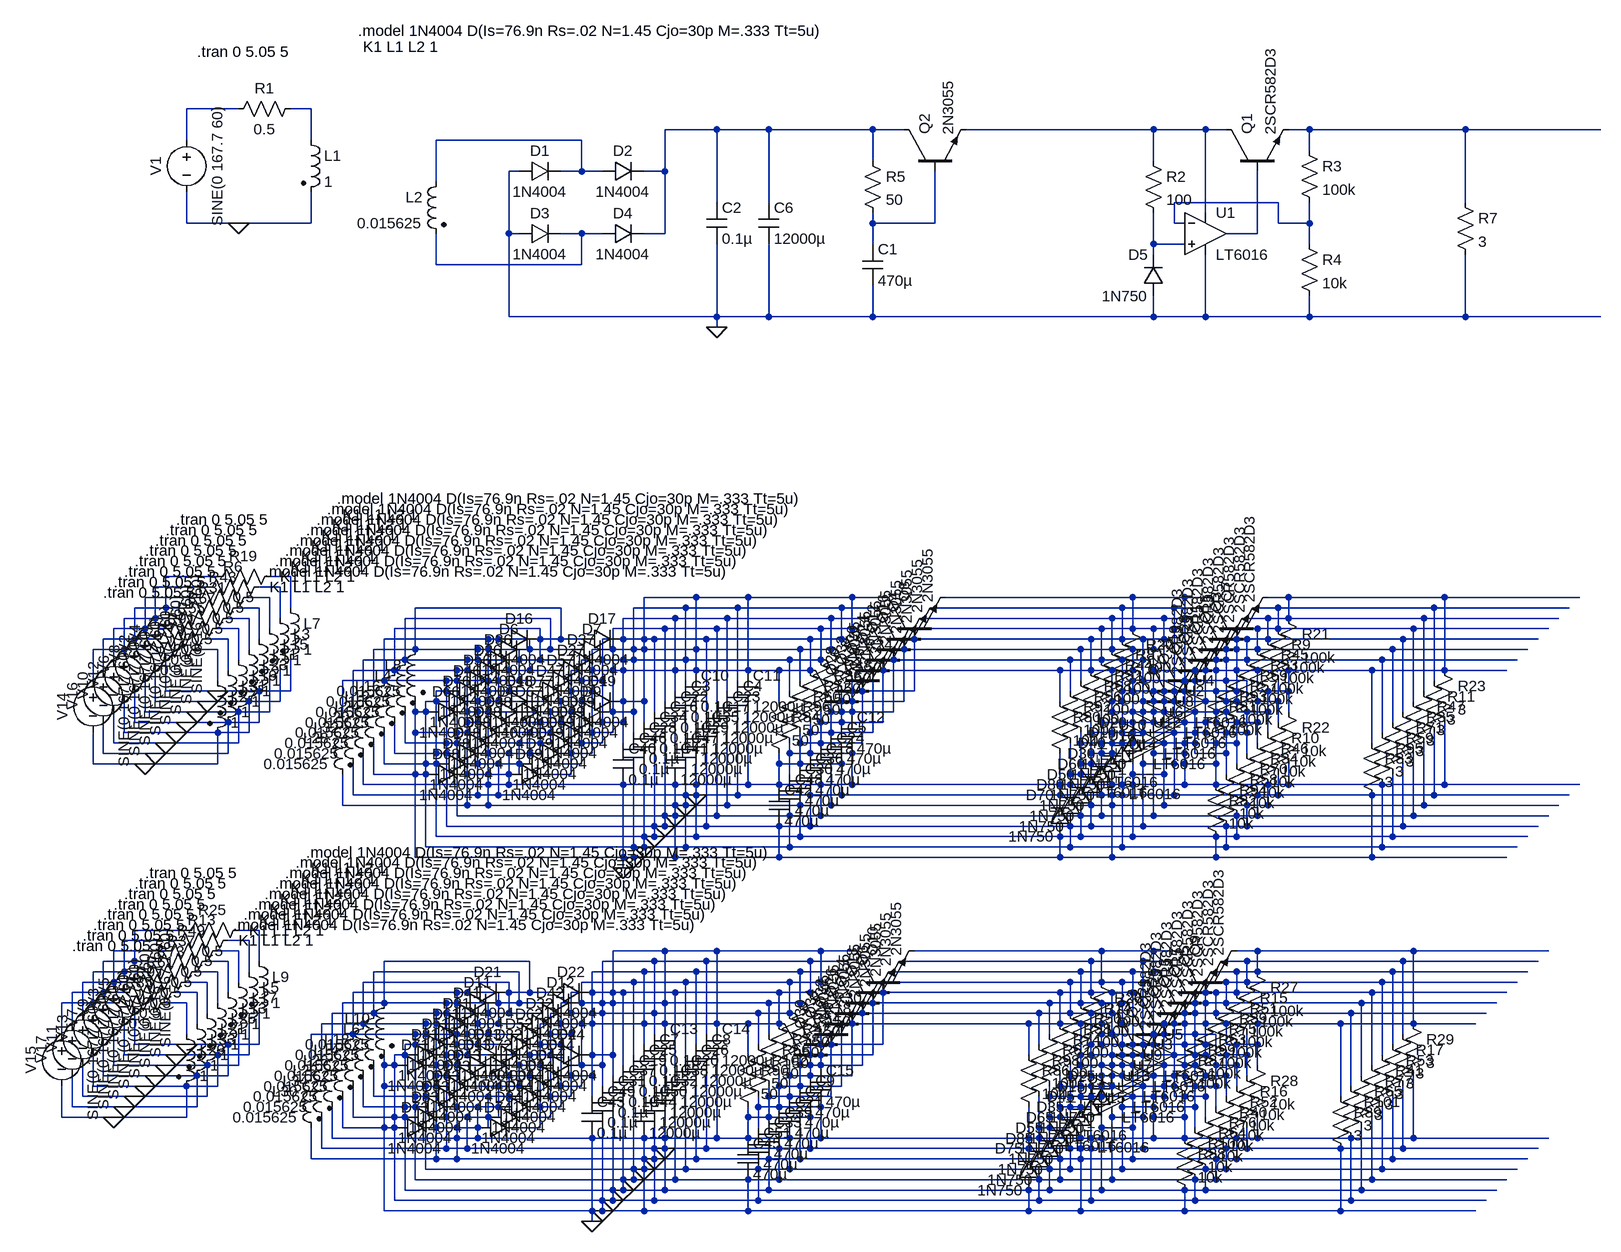
[diagram p0: schematic 13.8v_linear_power_supply.asc]
* 13.8v_linear_power_supply.asc
R1 N002 N001 0.5
V1 N001 0 SINE(0 167.7 60)
L1 N002 0 1
L2 N006 N009 0.015625
D1 0 N006 1N4004
D2 N006 N003 1N4004
D3 0 N009 1N4004
D4 N009 N003 1N4004
C2 N003 0 0.1µ
C6 N003 0 12000µ
D5 0 N011 1N750
R2 N004 N011 100
R3 N005 N007 100k
R4 N007 0 10k
Q1 N004 N010 N005 0 2SCR582D3
R7 N005 0 3
R5 N003 N008 50
C1 N008 0 470µ
Q2 N003 N008 N004 0 2N3055
* U1: LT6016 (symbol OpAmps\LT6016 not available, pins judged from their places): In+=N011 In-=N007 V+=N004 V-=0 OUT=N010
R6 N015 N014 0.5
V2 N014 0 SINE(0 167.7 60)
L3 N015 0 1
L4 0 0 0.015625
D6 0 0 1N4004
D7 0 0 1N4004
D8 0 0 1N4004
D9 0 0 1N4004
C3 0 N024 0.1µ
C4 0 0 12000µ
D10 0 0 1N750
R8 0 0 100
R9 0 0 100k
R10 0 0 10k
Q3 0 0 0 0 2SCR582D3
R11 0 0 3
R12 0 0 50
C5 0 0 470µ
Q4 0 0 0 0 2N3055
* U2: LT6016 (symbol OpAmps\LT6016 not available, pins judged from their places): In+=0 In-=0 V+=0 V-=0 OUT=0
R13 N029 N028 0.5
V3 N028 0 SINE(0 167.7 60)
L5 N029 0 1
L6 0 0 0.015625
D11 0 0 1N4004
D12 0 0 1N4004
D13 0 0 1N4004
D14 0 0 1N4004
C7 0 N038 0.1µ
C8 0 0 12000µ
D15 0 0 1N750
R14 0 0 100
R15 0 0 100k
R16 0 0 10k
Q5 0 0 0 0 2SCR582D3
R17 0 0 3
R18 0 0 50
C9 0 0 470µ
Q6 0 0 0 0 2N3055
* U3: LT6016 (symbol OpAmps\LT6016 not available, pins judged from their places): In+=0 In-=0 V+=0 V-=0 OUT=0
R19 N013 N012 0.5
V4 N012 0 SINE(0 167.7 60)
L7 N013 0 1
L8 0 0 0.015625
D16 0 0 1N4004
D17 0 0 1N4004
D18 0 0 1N4004
D19 0 0 1N4004
C10 0 N023 0.1µ
C11 0 0 12000µ
D20 0 0 1N750
R20 0 0 100
R21 0 0 100k
R22 0 0 10k
Q7 0 0 0 0 2SCR582D3
R23 0 0 3
R24 0 0 50
C12 0 0 470µ
Q8 0 0 0 0 2N3055
* U4: LT6016 (symbol OpAmps\LT6016 not available, pins judged from their places): In+=0 In-=0 V+=0 V-=0 OUT=0
R25 N027 N026 0.5
V5 N026 0 SINE(0 167.7 60)
L9 N027 0 1
L10 0 0 0.015625
D21 0 0 1N4004
D22 0 0 1N4004
D23 0 0 1N4004
D24 0 0 1N4004
C13 0 N037 0.1µ
C14 0 0 12000µ
D25 0 0 1N750
R26 0 0 100
R27 0 0 100k
R28 0 0 10k
Q9 0 0 0 0 2SCR582D3
R29 0 0 3
R30 0 0 50
C15 0 0 470µ
Q10 0 0 0 0 2N3055
* U5: LT6016 (symbol OpAmps\LT6016 not available, pins judged from their places): In+=0 In-=0 V+=0 V-=0 OUT=0
R31 N018 N012 0.5
V6 N012 0 SINE(0 167.7 60)
L11 N018 0 1
L12 0 0 0.015625
D26 0 0 1N4004
D27 0 0 1N4004
D28 0 0 1N4004
D29 0 0 1N4004
C16 0 0 0.1µ
C17 0 0 12000µ
D30 0 0 1N750
R32 0 0 100
R33 0 0 100k
R34 0 0 10k
Q11 0 0 0 0 2SCR582D3
R35 0 0 3
R36 0 0 50
C18 0 0 470µ
Q12 0 0 0 0 2N3055
* U6: LT6016 (symbol OpAmps\LT6016 not available, pins judged from their places): In+=0 In-=0 V+=0 V-=0 OUT=0
R37 N032 N026 0.5
V7 N026 0 SINE(0 167.7 60)
L13 N032 0 1
L14 0 0 0.015625
D31 0 0 1N4004
D32 0 0 1N4004
D33 0 0 1N4004
D34 0 0 1N4004
C19 0 0 0.1µ
C20 0 0 12000µ
D35 0 0 1N750
R38 0 0 100
R39 0 0 100k
R40 0 0 10k
Q13 0 0 0 0 2SCR582D3
R41 0 0 3
R42 0 0 50
C21 0 0 470µ
Q14 0 0 0 0 2N3055
* U7: LT6016 (symbol OpAmps\LT6016 not available, pins judged from their places): In+=0 In-=0 V+=0 V-=0 OUT=0
R43 N017 N016 0.5
V8 N016 0 SINE(0 167.7 60)
L15 N017 0 1
L16 0 0 0.015625
D36 0 0 1N4004
D37 0 0 1N4004
D38 0 0 1N4004
D39 0 0 1N4004
C22 0 N025 0.1µ
C23 0 0 12000µ
D40 0 0 1N750
R44 0 0 100
R45 0 0 100k
R46 0 0 10k
Q15 0 0 0 0 2SCR582D3
R47 0 0 3
R48 0 0 50
C24 0 0 470µ
Q16 0 0 0 0 2N3055
* U8: LT6016 (symbol OpAmps\LT6016 not available, pins judged from their places): In+=0 In-=0 V+=0 V-=0 OUT=0
R49 N031 N030 0.5
V9 N030 0 SINE(0 167.7 60)
L17 N031 0 1
L18 0 0 0.015625
D41 0 0 1N4004
D42 0 0 1N4004
D43 0 0 1N4004
D44 0 0 1N4004
C25 0 N039 0.1µ
C26 0 0 12000µ
D45 0 0 1N750
R50 0 0 100
R51 0 0 100k
R52 0 0 10k
Q17 0 0 0 0 2SCR582D3
R53 0 0 3
R54 0 0 50
C27 0 0 470µ
Q18 0 0 0 0 2N3055
* U9: LT6016 (symbol OpAmps\LT6016 not available, pins judged from their places): In+=0 In-=0 V+=0 V-=0 OUT=0
R55 N020 N016 0.5
V10 N016 0 SINE(0 167.7 60)
L19 N020 0 1
L20 0 0 0.015625
D46 0 0 1N4004
D47 0 0 1N4004
D48 0 0 1N4004
D49 0 0 1N4004
C28 0 0 0.1µ
C29 N023 0 12000µ
D50 0 0 1N750
R56 0 0 100
R57 0 0 100k
R58 0 0 10k
Q19 0 0 0 0 2SCR582D3
R59 0 0 3
R60 0 0 50
C30 0 0 470µ
Q20 0 0 0 0 2N3055
* U10: LT6016 (symbol OpAmps\LT6016 not available, pin order unknown); nets seen at it: 
R61 N034 N030 0.5
V11 N030 0 SINE(0 167.7 60)
L21 N034 0 1
L22 0 0 0.015625
D51 0 0 1N4004
D52 0 0 1N4004
D53 0 0 1N4004
D54 0 0 1N4004
C31 0 0 0.1µ
C32 N037 0 12000µ
D55 0 0 1N750
R62 0 0 100
R63 0 0 100k
R64 0 0 10k
Q21 0 0 0 0 2SCR582D3
R65 0 0 3
R66 0 0 50
C33 0 0 470µ
Q22 0 0 0 0 2N3055
* U11: LT6016 (symbol OpAmps\LT6016 not available, pin order unknown); nets seen at it: 
R67 N019 N014 0.5
V12 N014 0 SINE(0 167.7 60)
L23 N019 0 1
L24 0 0 0.015625
D56 0 0 1N4004
D57 0 0 1N4004
D58 0 0 1N4004
D59 0 0 1N4004
C34 0 0 0.1µ
C35 0 0 12000µ
D60 0 0 1N750
R68 0 0 100
R69 0 0 100k
R70 0 0 10k
Q23 0 0 0 0 2SCR582D3
R71 0 0 3
R72 0 0 50
C36 0 0 470µ
Q24 0 0 0 0 2N3055
* U12: LT6016 (symbol OpAmps\LT6016 not available, pins judged from their places): In+=0 In-=0 V+=0 V-=0 OUT=0
R73 N033 N028 0.5
V13 N028 0 SINE(0 167.7 60)
L25 N033 0 1
L26 0 0 0.015625
D61 0 0 1N4004
D62 0 0 1N4004
D63 0 0 1N4004
D64 0 0 1N4004
C37 0 0 0.1µ
C38 0 0 12000µ
D65 0 0 1N750
R74 0 0 100
R75 0 0 100k
R76 0 0 10k
Q25 0 0 0 0 2SCR582D3
R77 0 0 3
R78 0 0 50
C39 0 0 470µ
Q26 0 0 0 0 2N3055
* U13: LT6016 (symbol OpAmps\LT6016 not available, pins judged from their places): In+=0 In-=0 V+=0 V-=0 OUT=0
R79 N022 N014 0.5
V14 N014 0 SINE(0 167.7 60)
L27 N022 0 1
L28 0 0 0.015625
D66 0 0 1N4004
D67 0 0 1N4004
D68 0 0 1N4004
D69 0 0 1N4004
C40 0 0 0.1µ
C41 N025 0 12000µ
D70 0 0 1N750
R80 0 0 100
R81 0 0 100k
R82 0 0 10k
Q27 0 0 0 0 2SCR582D3
R83 0 0 3
R84 0 0 50
C42 0 0 470µ
Q28 0 0 0 0 2N3055
* U14: LT6016 (symbol OpAmps\LT6016 not available, pin order unknown); nets seen at it: 0
R85 N036 N028 0.5
V15 N028 0 SINE(0 167.7 60)
L29 N036 0 1
L30 0 0 0.015625
D71 0 0 1N4004
D72 0 0 1N4004
D73 0 0 1N4004
D74 0 0 1N4004
C43 0 0 0.1µ
C44 N039 0 12000µ
D75 0 0 1N750
R86 0 0 100
R87 0 0 100k
R88 0 0 10k
Q29 0 0 0 0 2SCR582D3
R89 0 0 3
R90 0 0 50
C45 0 0 470µ
Q30 0 0 0 0 2N3055
* U15: LT6016 (symbol OpAmps\LT6016 not available, pin order unknown); nets seen at it: 0
R91 N021 N012 0.5
V16 N012 0 SINE(0 167.7 60)
L31 N021 0 1
L32 0 0 0.015625
D76 0 0 1N4004
D77 0 0 1N4004
D78 0 0 1N4004
D79 0 0 1N4004
C46 0 0 0.1µ
C47 N024 0 12000µ
D80 0 0 1N750
R92 0 0 100
R93 0 0 100k
R94 0 0 10k
Q31 0 0 0 0 2SCR582D3
R95 0 0 3
R96 0 0 50
C48 0 0 470µ
Q32 0 0 0 0 2N3055
* U16: LT6016 (symbol OpAmps\LT6016 not available, pin order unknown); nets seen at it: 
R97 N035 N026 0.5
V17 N026 0 SINE(0 167.7 60)
L33 N035 0 1
L34 0 0 0.015625
D81 0 0 1N4004
D82 0 0 1N4004
D83 0 0 1N4004
D84 0 0 1N4004
C49 0 0 0.1µ
C50 N038 0 12000µ
D85 0 0 1N750
R98 0 0 100
R99 0 0 100k
R100 0 0 10k
Q33 0 0 0 0 2SCR582D3
R101 0 0 3
R102 0 0 50
C51 0 0 470µ
Q34 0 0 0 0 2N3055
* U17: LT6016 (symbol OpAmps\LT6016 not available, pin order unknown); nets seen at it: 
.model D D
.lib standard.dio
.model NPN NPN
.model PNP PNP
.lib standard.bjt
.tran 0 5.05 5
K1 L1 L2 1
.model 1N4004 D(Is=76.9n Rs=.02 N=1.45 Cjo=30p M=.333 Tt=5u)
.tran 0 5.05 5
K1 L1 L2 1
.model 1N4004 D(Is=76.9n Rs=.02 N=1.45 Cjo=30p M=.333 Tt=5u)
.tran 0 5.05 5
K1 L1 L2 1
.model 1N4004 D(Is=76.9n Rs=.02 N=1.45 Cjo=30p M=.333 Tt=5u)
.tran 0 5.05 5
K1 L1 L2 1
.model 1N4004 D(Is=76.9n Rs=.02 N=1.45 Cjo=30p M=.333 Tt=5u)
.tran 0 5.05 5
K1 L1 L2 1
.model 1N4004 D(Is=76.9n Rs=.02 N=1.45 Cjo=30p M=.333 Tt=5u)
.tran 0 5.05 5
K1 L1 L2 1
.model 1N4004 D(Is=76.9n Rs=.02 N=1.45 Cjo=30p M=.333 Tt=5u)
.tran 0 5.05 5
K1 L1 L2 1
.model 1N4004 D(Is=76.9n Rs=.02 N=1.45 Cjo=30p M=.333 Tt=5u)
.tran 0 5.05 5
K1 L1 L2 1
.model 1N4004 D(Is=76.9n Rs=.02 N=1.45 Cjo=30p M=.333 Tt=5u)
.tran 0 5.05 5
K1 L1 L2 1
.model 1N4004 D(Is=76.9n Rs=.02 N=1.45 Cjo=30p M=.333 Tt=5u)
.tran 0 5.05 5
K1 L1 L2 1
.model 1N4004 D(Is=76.9n Rs=.02 N=1.45 Cjo=30p M=.333 Tt=5u)
.tran 0 5.05 5
K1 L1 L2 1
.model 1N4004 D(Is=76.9n Rs=.02 N=1.45 Cjo=30p M=.333 Tt=5u)
.tran 0 5.05 5
K1 L1 L2 1
.model 1N4004 D(Is=76.9n Rs=.02 N=1.45 Cjo=30p M=.333 Tt=5u)
.tran 0 5.05 5
K1 L1 L2 1
.model 1N4004 D(Is=76.9n Rs=.02 N=1.45 Cjo=30p M=.333 Tt=5u)
.tran 0 5.05 5
K1 L1 L2 1
.model 1N4004 D(Is=76.9n Rs=.02 N=1.45 Cjo=30p M=.333 Tt=5u)
.tran 0 5.05 5
K1 L1 L2 1
.model 1N4004 D(Is=76.9n Rs=.02 N=1.45 Cjo=30p M=.333 Tt=5u)
.tran 0 5.05 5
K1 L1 L2 1
.model 1N4004 D(Is=76.9n Rs=.02 N=1.45 Cjo=30p M=.333 Tt=5u)
.tran 0 5.05 5
K1 L1 L2 1
.model 1N4004 D(Is=76.9n Rs=.02 N=1.45 Cjo=30p M=.333 Tt=5u)
.backanno
.end